# EAGLE design hive_module (EAGLE 9.6.2)
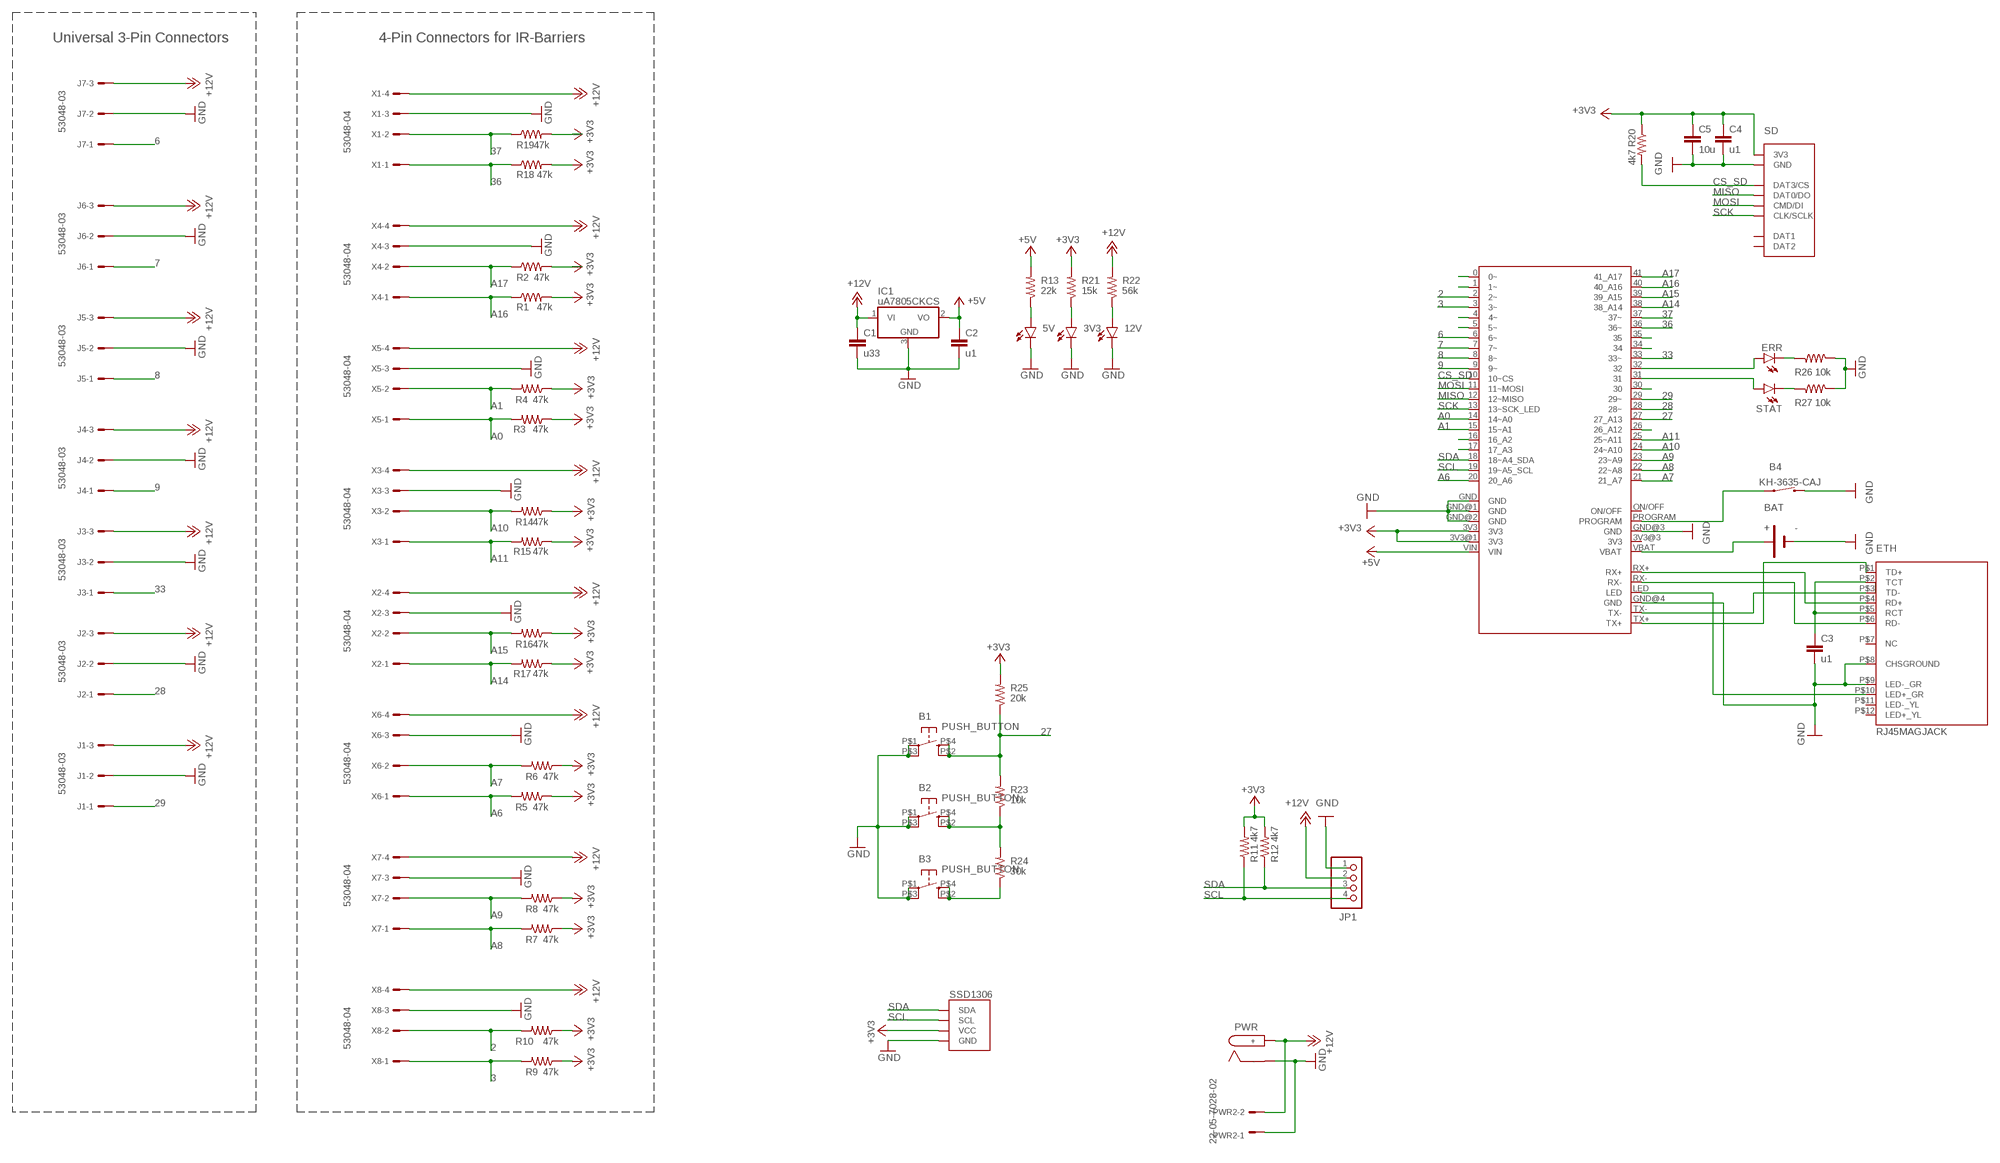
[diagram p0: schematic, sheet 1]

## Parts
3V3  LEDCHIP-LED0805  [CHIP-LED0805]
5V  LEDCHIP-LED0805  [CHIP-LED0805]
12V  LEDCHIP-LED0805  [CHIP-LED0805]
B1  PUSH_BUTTON  [PUSH_BUTTON]
B2  PUSH_BUTTON  [PUSH_BUTTON]
B3  PUSH_BUTTON  [PUSH_BUTTON]
B4  KH-3635-CAJ  [KH-3635-CAJ]
BAT  BS-08-B2AA002  [BS-08-B2AA002]
C1  u33  C-EUC0805  [C0805]
C2  u1  C-EUC0805  [C0805]
C3  u1  C-EUC0805  [C0805]
C4  u1  C-EUC0805  [C0805]
C5  10u  C-EUC0805  [C0805]
ERR  LEDCHIP-LED0805  [CHIP-LED0805]
ETH  RJ45MAGJACK  [LPJ4012AHNL]
IC1  uA7805CKCS  7805_TO252  [TO252]
J1  53048-03  [53048-03]
J2  53048-03  [53048-03]
J3  53048-03  [53048-03]
J4  53048-03  [53048-03]
J5  53048-03  [53048-03]
J6  53048-03  [53048-03]
J7  53048-03  [53048-03]
JP1  PINHD-1X4  [1X04]
PWR  DC-042C-Z-2.5-A  [DC-042C-Z-2.5-A]
PWR2  22-05-7028-02  [7395-02]
R1  47k  R-US_R0805  [R0805]
R2  47k  R-US_R0805  [R0805]
R3  47k  R-US_R0805  [R0805]
R4  47k  R-US_R0805  [R0805]
R5  47k  R-US_R0805  [R0805]
R6  47k  R-US_R0805  [R0805]
R7  47k  R-US_R0805  [R0805]
R8  47k  R-US_R0805  [R0805]
R9  47k  R-US_R0805  [R0805]
R10  47k  R-US_R0805  [R0805]
R11  4k7  R-US_R0805  [R0805]
R12  4k7  R-US_R0805  [R0805]
R13  22k  R-US_R0805  [R0805]
R14  47k  R-US_R0805  [R0805]
R15  47k  R-US_R0805  [R0805]
R16  47k  R-US_R0805  [R0805]
R17  47k  R-US_R0805  [R0805]
R18  47k  R-US_R0805  [R0805]
R19  47k  R-US_R0805  [R0805]
R20  4k7  R-US_R0805  [R0805]
R21  15k  R-US_R0805  [R0805]
R22  56k  R-US_R0805  [R0805]
R23  10k  R-US_R0805  [R0805]
R24  30k  R-US_R0805  [R0805]
R25  20k  R-US_R0805  [R0805]
R26  10k  R-US_R0805  [R0805]
R27  10k  R-US_R0805  [R0805]
SD  TF-011  [TF-011]
SSD1306  SSD1306  [SSD1306]
STAT  LEDCHIP-LED0805  [CHIP-LED0805]
U$1  TEENSY41  [TEENSY41]
X1  53048-04  [53048-04]
X2  53048-04  [53048-04]
X3  53048-04  [53048-04]
X4  53048-04  [53048-04]
X5  53048-04  [53048-04]
X6  53048-04  [53048-04]
X7  53048-04  [53048-04]
X8  53048-04  [53048-04]

## Nets
2: R10.2 U$1.2(2~) X8.2
3: R9.2 U$1.3(3~) X8.1
6: J7.1 U$1.6(6~)
7: J6.1 U$1.7(7~)
8: J5.1 U$1.8(8~)
9: J4.1 U$1.9(9~)
27: B1.P$2(S1) B1.P$4(S) R23.2 R25.1 U$1.27(27_A13)
28: J2.1 U$1.28(28~)
29: J1.1 U$1.29(29~)
33: J3.1 U$1.33(33~)
36: R18.1 U$1.36(36~) X1.1
37: R19.1 U$1.37(37~) X1.2
+3V3: C4.1 C5.1 R1.2 R2.2 R3.1 R4.1 R5.1 R6.1 R7.1 R8.1 R9.1 R10.1 R11.2 R12.2 R14.1 R15.1 R16.1 R17.1 R18.2 R19.2 R20.1 R21.2 R25.2 SD.P$4(3V3) SSD1306.P$2(VCC) U$1.3V3 U$1.3V3@1(3V3)
+5V: C2.1 IC1.2(VO) R13.2 U$1.VIN
+12V: C1.1 IC1.1(VI) J1.3 J2.3 J3.3 J4.3 J5.3 J6.3 J7.3 JP1.2 PWR2.2 PWR.P$6(+) R22.2 X1.4 X2.4 X3.4 X4.4 X5.4 X6.4 X7.4 X8.4
A0: R3.2 U$1.14(14~A0) X5.1
A1: R4.2 U$1.15(15~A1) X5.2
A6: R5.2 U$1.20(20_A6) X6.1
A7: R6.2 U$1.21(21_A7) X6.2
A8: R7.2 U$1.22(22~A8) X7.1
A9: R8.2 U$1.23(23~A9) X7.2
A10: R14.2 U$1.24(24~A10) X3.2
A11: R15.2 U$1.25(25~A11) X3.1
A14: R17.2 U$1.38(38_A14) X2.1
A15: R16.2 U$1.39(39_A15) X2.2
A16: R1.1 U$1.40(40_A16) X4.1
A17: R2.1 U$1.41(41_A17) X4.2
CS_SD: R20.2 SD.P$2(DAT3/CS) U$1.10(10~CS)
GND: 3V3.C 5V.C 12V.C B1.P$1(P) B1.P$3(P1) B2.P$1(P) B2.P$3(P1) B3.P$1(P) B3.P$3(P1) B4.P$2 BAT.- C1.2 C2.2 C3.2 C4.2 C5.2 ETH.P$8(CHSGROUND) ETH.P$9(LED-_GR) IC1.3(GND) J1.2 J2.2 J3.2 J4.2 J5.2 J6.2 J7.2 JP1.1 PWR2.1 PWR.P$1(-) PWR.P$2(-) PWR.P$3(-) PWR.P$4(-) PWR.P$5(-) R26.2 R27.2 SD.P$6(GND) SD.P$9(GND) SD.P$10(GND) SD.P$11(GND) SD.P$12(GND) SSD1306.P$1(GND) U$1.GND U$1.GND@1(GND) U$1.GND@2(GND) U$1.GND@3(GND) U$1.GND@4(GND) X1.3 X2.3 X3.3 X4.3 X5.3 X6.3 X7.3 X8.3
MISO: SD.P$7(DAT0/DO) U$1.12(12~MISO)
MOSI: SD.P$3(CMD/DI) U$1.11(11~MOSI)
N$1: ETH.P$1(TD+) U$1.TX+
N$2: ETH.P$3(TD-) U$1.TX-
N$3: 3V3.A R21.1
N$4: ETH.P$6(RD-) U$1.RX-
N$5: ETH.P$4(RD+) U$1.RX+
N$6: ETH.P$10(LED+_GR) U$1.LED
N$7: 12V.A R22.1
N$8: C3.1 ETH.P$2(TCT) ETH.P$5(RCT)
N$9: BAT.+ U$1.VBAT
N$10: B4.P$1 U$1.PROGRAM
N$11: ERR.A U$1.32
N$12: B3.P$2(S1) B3.P$4(S) R24.1
N$13: B2.P$2(S1) B2.P$4(S) R23.1 R24.2
N$14: U$1.0(0~)
N$15: U$1.1(1~)
N$16: U$1.4(4~)
N$17: U$1.5(5~)
N$18: U$1.35
N$19: U$1.34
N$20: ERR.C R26.1
N$21: R27.1 STAT.C
N$22: STAT.A U$1.31
N$23: U$1.30
N$24: U$1.26(26_A12)
N$25: 5V.A R13.1
N$26: U$1.16(16_A2)
N$27: U$1.17(17_A3)
SCK: SD.P$5(CLK/SCLK) U$1.13(13~SCK_LED)
SCL: JP1.4 R11.1 SSD1306.P$3(SCL) U$1.19(19~A5_SCL)
SDA: JP1.3 R12.1 SSD1306.P$4(SDA) U$1.18(18~A4_SDA)
Unconnected: ETH.P$7(NC) ETH.P$11(LED-_YL) ETH.P$12(LED+_YL) SD.P$1(DAT2) SD.P$8(DAT1) U$1.3V3@3(3V3) U$1.ON/OFF

## Notes on the sheet
- Universal 3-Pin Connectors | 4-Pin Connectors for IR-Barriers

## Library data of the parts
3V3 5V 12V ERR STAT = led:LED: LED OSRAM: - CHIPLED LG R971, LG N971, LY N971, LG Q971, LY Q971, LO R971, LY R971 LH N974, LH R974 LS Q976, LO Q976, LY Q976 LO Q996 - Hyper CHIPLED LW Q18S LB Q993, LB Q99A, LB R99A - SideLED LS A670, LO A670, LY A670, LG A670, LP A670 LB A673, LV A673, LT A673, LW A673 LH A674 LY A675 LS A676, LA A676, LO A676, LY A676, LW A676 LS A679, LY A679, LG A679 - Hyper Micro SIDELED® LS Y876, LA Y876, LO Y876, LY Y876 LT Y87S - SmartLED LW L88C, LW L88S LB L89C, LB L89S, LG L890 LS L89K, LO L89K, LY L89K LS L896, LA L896, LO L896, LY L896 - TOPLED LS T670, LO T670, LY T670, LG T670, LP T670 LSG T670, LSP T670, LSY T670, LOP T670, LYG T670 LG T671, LOG T671, LSG T671 LB T673, LV T673, LT T673, LW T673 LH T674 LS T676, LA T676, LO T676, LY T676, LB T676, LH T676, LSB T676, LW T676 LB T67C, LV T67C, LT T67C, LS T67K, LO T67K, LY T67K, LW E67C LS E67B, LA E67B, LO E67B, LY E67B, LB E67C, LV E67C, LT E67C LW T67C LS T679, LY T679, LG T679 LS T770, LO T770, LY T770, LG T770, LP T770 LB T773, LV T773, LT T773, LW T773 LH T774 LS E675, LA E675, LY E675, LS T675 LS T776, LA T776, LO T776, LY T776, LB T776 LHGB T686 LT T68C, LB T68C - Hyper Mini TOPLED® LB M676 - Mini TOPLED Santana® LG M470 LS M47K, LO M47K, LY M47K Source: http://www.osram.convergy.de LUXEON: - LUMILED® LXK2-PW12-R00, LXK2-PW12-S00, LXK2-PW14-U00, LXK2-PW14-V00 LXK2-PM12-R00, LXK2-PM12-S00, LXK2-PM14-U00 LXK2-PE12-Q00, LXK2-PE12-R00, LXK2-PE12-S00, LXK2-PE14-T00, LXK2-PE14-U00 LXK2-PB12-K00, LXK2-PB12-L00, LXK2-PB12-M00, LXK2-PB14-N00, LXK2-PB14-P00, LXK2-PB14-Q00 LXK2-PR12-L00, LXK2-PR12-M00, LXK2-PR14-Q00, LXK2-PR14-R00 LXK2-PD12-Q00, LXK2-PD12-R00, LXK2-PD12-S00 LXK2-PH12-R00, LXK2-PH12-S00 LXK2-PL12-P00, LXK2-PL12-Q00, LXK2-PL12-R00 Source: www.luxeon.com KINGBRIGHT: KA-3528ASYC Source: www.kingbright.com
B1-B3 = 000-my_library:PUSH_BUTTON: K2-6639SP-I4SC-04 C127507 jlcpcb
B4 = 000-my_library:KH-3635-CAJ
BAT = 000-my_library:BS-08-B2AA002
C1-C5 = rcl:C-EU: CAPACITOR, European symbol; SPICEPREFIX: C
ETH = 000-my_library:RJ45MAGJACK
IC1 = 000-my_library:7805_TO252
J1-J7 = con-molex:53?-03: CONNECTOR wire to board 1.25 mm (.049 inch) pitch header; MF: WALDOM/MOLEX; MPN: 53048-0310; OC_FARNELL: 9732918; OC_NEWARK: 38C9908
JP1 = pinhead:PINHD-1X4: PIN HEADER
PWR = 000-my_library:DC-042C-Z-2.5-A
PWR2 = con-molex:22-?-02: CONNECTOR wire to board 2.54 mm (.1 inch) pitch header; MF: MOLEX; OC_FARNELL: 9731601; OC_NEWARK: unknown
R1-R27 = rcl:R-US_: RESISTOR, American symbol; SPICEPREFIX: R
SD = 000-my_library:TF-011
SSD1306 = 000-my_library:SSD1306
U$1 = 000-my_library:TEENSY41
X1-X8 = con-molex:53?-04: CONNECTOR wire to board 1.25 mm (.049 inch) pitch header; MF: MOLEX; MPN: 53048-0410; OC_FARNELL: 1462887; OC_NEWARK: 57H4721

## Board
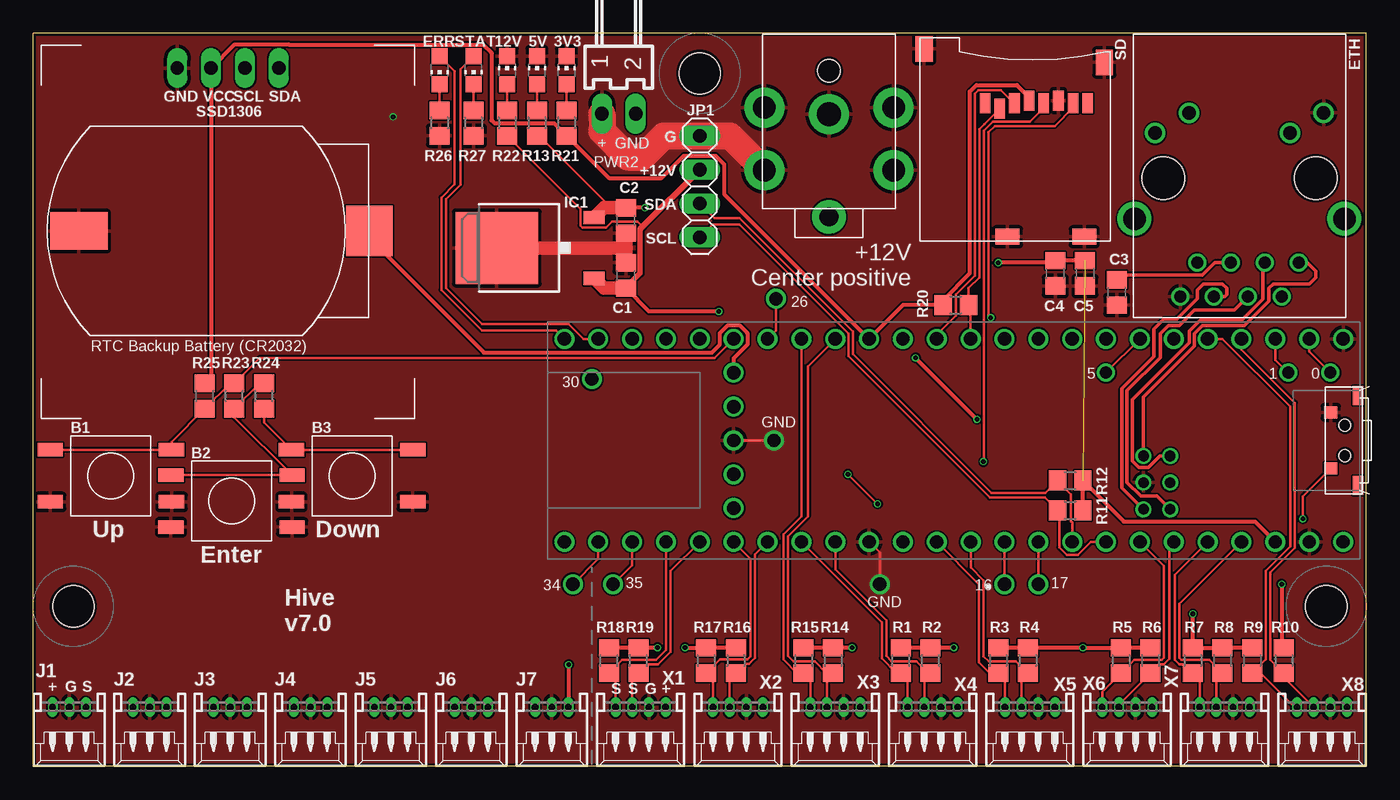
[diagram p1: board, top side]
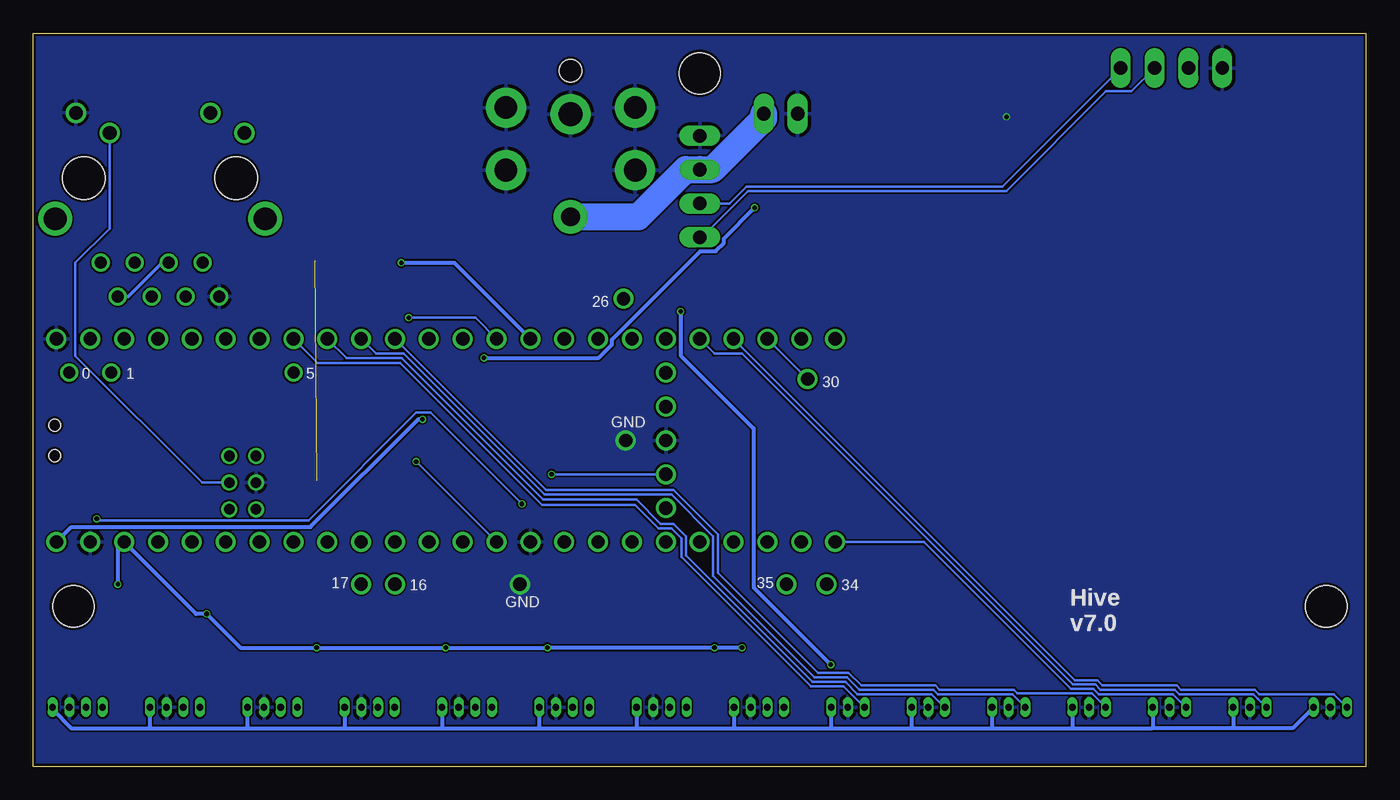
[diagram p2: board, bottom side, seen from below]

Size 100 x 55 mm. Coordinates in mm from the lower left corner, seen from the top.
Outline: 100,0 100,55 0,55 0,0 100,0
Copper layers (1*16): Top 0.035559375mm / dielectric 1.6mm / Bottom 0.035559375mm
Design rules "jlcpcb2layer": minimum track width 5mil, minimum drill 12mil, track to track 5mil, track to pad 5mil, pad to pad 5mil, via to via 5mil, smd to smd 5mil, copper to edge 8mil, drill to drill 6mil, minimum pad ring 5mil, minimum via ring 3mil, stop-mask expansion 2.5mil, vias tented up to drill 0mil, thermal gap 10mil
Holes 3.1 mm at 50,52 3,12 97,12

### Footprints (pad centres in the part's own frame; a part is rotated, then mirrored left to right if it is on the bottom)
CHIP-LED0805 = smd 1.2 x 1.2: A 0,-1.05; C 0,1.05
PUSH_BUTTON = smd 1.9 x 1: P$1 0,0; P$2 0,3.9; P$3 9.1,0; P$4 9.1,3.9
KH-3635-CAJ = smd 0.9 x 1: P$1 -2.1,1.05; P$2 2.1,1.05 | smd 1.45 x 0.8: P$3 -3.375,-1; P$4 3.375,-1 | hole 0.9: -1.15,0; 1.15,0
BS-08-B2AA002 = smd 3.5 x 3.8: + 13,0 | smd 4.3 x 2.8: - -8.8,0
C0805 = smd 1.3 x 1.5: 1 -0.95,0; 2 0.95,0
LPJ4012AHNL = drill 0.9: P$1 -4.445,6.35; P$2 -3.175,8.89; P$3 -1.905,6.35; P$4 -0.635,8.89; P$5 0.635,6.35; P$6 1.905,8.89; P$7 3.175,6.35; P$8 4.445,8.89 | drill 1.02: P$9 -6.325,-4.9; P$10 -3.785,-3.38; P$11 3.785,-4.9; P$12 6.325,-3.38 | drill 1.7: P$13 -7.875,3.05; P$14 7.875,3.05 | hole 3.2: -5.715,0; 5.715,0
TO252 = smd 1 x 1.6: 1 -2.28,-4.8; 2 2.28,-4.8 | smd 5.4 x 6.2: 3 0,2.5
53048-03 = drill 0.5 pad 0.698 long: 1 1.25,-1.25; 2 0,-1.25; 3 -1.25,-1.25
1X04 = drill 1.016 long: 1 -3.81,0; 2 -1.27,0; 3 1.27,0; 4 3.81,0
DC-042C-Z-2.5-A = drill 1.7 pad 3: P$1 5.5,4.85; P$2 10.2,4.85; P$3 5.5,-4.85; P$4 10.2,-4.85 | drill 1.8 pad 3: P$5 6,0 | drill 1.4 pad 2.54: P$6 13.7,0 | hole 1.7: 2.75,0
7395-02 = drill 1.016 long: 1 1.27,0; 2 -1.27,0
R0805 = smd 1.3 x 1.5: 1 -0.95,0; 2 0.95,0
TF-011 = smd 0.8 x 1.5: P$1 8.94,3.06; P$2 7.84,3.46; P$3 6.74,3.06; P$4 5.64,2.86; P$5 4.54,3.06; P$6 3.44,2.86; P$7 2.34,3.06; P$8 1.24,3.06 | smd 1.3 x 1.9: P$9 13.52,-1.02; P$10 0,0 | smd 1.8 x 1.2: P$11 1.51,13.08; P$12 7.26,13.08
SSD1306 = drill 1 long: P$1 -3.81,0; P$2 -1.27,0; P$3 1.27,0; P$4 3.81,0
TEENSY41 = drill 1: 0 2.54,0; 1 5.08,0; 2 7.62,0; 3 10.16,0; 3V3 35.56,0; 3V3@1 5.08,15.24; 3V3@3 45.72,5.08; 4 12.7,0; 5 15.24,0; 6 17.78,0; 7 20.32,0; 8 22.86,0; 9 25.4,0; 10 27.94,0; 11 30.48,0; 12 33.02,0; 13 33.02,15.24; 14 30.48,15.24; 15 27.94,15.24; 16 25.4,15.24; 17 22.86,15.24; 18 20.32,15.24; 19 17.78,15.24; 20 15.24,15.24; 21 12.7,15.24; 22 10.16,15.24; 23 7.62,15.24; 24 38.1,0; 25 40.64,0; 26 43.18,0; 27 45.72,0; 28 48.26,0; 29 50.8,0; 30 53.34,0; 31 55.88,0; 32 58.42,0; 33 58.42,15.24; 34 55.88,15.24; 35 53.34,15.24; 36 50.8,15.24; 37 48.26,15.24; 38 45.72,15.24; 39 43.18,15.24; 40 40.64,15.24; 41 38.1,15.24; GND 0,0; GND@1 35.56,15.24; GND@2 2.54,15.24; GND@4 45.72,7.62; ON/OFF 45.72,12.7; PROGRAM 45.72,10.16; VBAT 45.72,2.54; VIN 0,15.24 | drill 0.8: GND@3 14.97,10.79; LED 12.97,10.79; RX+ 12.97,12.79; RX- 14.97,12.79; TX+ 14.97,8.79; TX- 12.97,8.79
53048-04 = drill 0.5 pad 0.698 long: 1 1.875,-1.25; 2 0.625,-1.25; 3 -0.625,-1.25; 4 -1.875,-1.25

### Placement (x,y rotation side)
3V3  40.01,52.23 0 top
5V  37.78,52.23 0 top
12V  35.56,52.23 0 top
B1  1.27,19.84 0 top
B2  10.32,17.94 0 top
B3  19.37,19.84 0 top
B4  98.4,24.45 90 top
BAT  12.22,40.16 0 top
C1  44.45,36.83 90 top
C2  44.45,40.96 270 top
C3  81.28,35.56 270 top
C4  76.68,36.99 270 top
C5  78.9,36.99 270 top
ERR  30.48,52.23 180 top
ETH  90.49,44.13 180 top
IC1  37.27,38.89 90 top
J1  2.7,3.17 180 top
J2  8.73,3.17 180 top
J3  14.76,3.17 180 top
J4  20.8,3.17 180 top
J5  26.83,3.17 180 top
J6  32.86,3.17 180 top
J7  38.89,3.17 180 top
JP1  50,43.5 270 top
PWR  59.69,54.93 270 top
PWR2  43.92,48.97 180 top
R1  65.09,7.94 90 top
R2  67.31,7.94 90 top
R3  72.39,7.94 270 top
R4  74.61,7.94 270 top
R5  81.6,7.94 270 top
R6  83.82,7.94 270 top
R7  87,7.94 270 top
R8  89.22,7.94 270 top
R9  91.44,7.94 270 top
R10  93.82,7.94 270 top
R11  77.79,19.21 0 top
R12  77.79,21.43 0 top
R13  37.78,48.26 270 top
R14  60.01,7.94 270 top
R15  57.78,7.94 270 top
R16  52.7,7.94 270 top
R17  50.48,7.94 270 top
R18  43.18,7.94 90 top
R19  45.4,7.94 90 top
R20  69.22,34.61 0 top
R21  40.01,48.26 270 top
R22  35.56,48.26 270 top
R23  15.08,27.78 90 top
R24  17.3,27.78 90 top
R25  12.86,27.78 90 top
R26  30.48,48.26 270 top
R27  33.02,48.26 270 top
SD  80.35,52.82 180 top
SSD1306  14.61,52.39 0 top
STAT  33.02,52.23 180 top
U$1  98.27,32.07 180 top
X1  45.56,3.17 180 top
X2  52.86,3.17 180 top
X3  60.17,3.17 180 top
X4  67.47,3.17 180 top
X5  74.77,3.17 180 top
X6  82.07,3.17 180 top
X7  89.38,3.17 180 top
X8  96.68,3.17 180 top

### Tracks (layer width: path | path; a pad name or v marks a point on that pad's centre or on a via)
2
  Top 0.203: U$1.2 90.65,31.27 94.65,27.27 94.65,16.36 92.82,14.53 92.82,7.99 R10.2 93.82,6.67 96.05,4.44 X8.2
3
  Top 0.203: U$1.3 89.22,32.07 94.3,26.99 94.3,16.51 92.46,14.67 92.46,8.01 R9.2 92.08,6.99 94.64,4.42 X8.1
6
  Bottom 0.203: U$1.6 78.68,30.26 72.49,30.26 61.84,19.62 54.86,19.62 53.08,17.84 52.13,17.84 51.38,17.09 51.38,15.7 41.67,5.99 39.21,5.99 J7.1
7
  Bottom 0.203: U$1.7 76.5,30.62 72.37,30.62 61.75,20 54.74,20 52.93,18.19 51.98,18.19 51.02,17.23 51.02,15.81 41.54,6.32 39.07,6.32 38.16,5.41 32.61,5.41 31.63,4.42 J6.1
8
  Bottom 0.203: U$1.8 74.3,30.96 72.23,30.96 61.65,20.38 52.13,20.38 49,17.25 49,14.29 41.39,6.68 38.96,6.68 38.02,5.74 32.47,5.74 32.14,5.41 26.56,5.41 J5.1
9
  Bottom 0.203: U$1.9 61.53,20.73 51.98,20.73 48.64,17.39 48.64,14.52 41.14,7.01 38.83,7.01 37.89,6.07 32.34,6.07 32.01,5.74 26.43,5.74 26.16,5.47 20.59,5.47 J4.1
27
  Top 0.203: B1.P$2 B1.P$4 10.37,24.34 R25.1 14.76,28.73 R23.2 16.99,30.64 51.12,30.64 U$1.27
28
  Bottom 0.203: U$1.28 48.9,30.96 46.83,30.96 22.01,6.13 20.32,6.13 19.93,5.74 14.36,5.74 14.03,5.41 8.48,5.41 8.13,5.06 8.12,5.06 J2.1
29
  Bottom 0.203: J1.1 2.43,5.41 8.01,5.41 8.34,5.74 13.89,5.74 14.22,6.07 19.79,6.07 20.18,6.46 21.86,6.46 U$1.29
33
  Bottom 0.203: U$1.33 33.18,16.83 22.15,5.8 20.46,5.8 20.06,5.41 14.5,5.41 J3.1
36
  Top 0.203: U$1.36 47.47,8.72 46.73,7.98 44.18,7.98 R18.1 43.69,6.48 X1.1
37
  Top 0.203: U$1.37 47.83,14.65 47.83,8.57 46.88,7.63 46.04,7.63 R19.1 44.94,6.52 X1.2
+3V3  (via drill 0.35)  (1 unrouted)
  Top 0.305: R8.1 R7.1 v87,11.43 | R8.1 | v69.06,8.89 v69.05,8.89 R2.2 R1.2 | R6.1 R5.1 v78.74,8.89 R4.1 R3.1 | R15.1 R14.1 v61.43,8.89 v61.44,8.89 | R18.2 R19.2 v46.83,8.89 | 52.86,8.89 R16.1 R17.1 | 50.64,8.89 R17.1 | R11.2 R12.2 81.81,18.36 91.65,18.36 U$1.3V3@1 | R9.1 R8.1 | v93.66,13.65 93.66,9.05 R10.1 | v48.9,8.89 R17.1 | C5.1 C4.1 76.52,37.78 v72.39,37.78 | R25.2 13.34,29.21 SSD1306.P$2 15.11,54.17 19.16,54.17 19.17,54.16 33.74,54.16 34.37,53.53 34.37,48.48 34.61,48.24 39.08,48.24 R21.2 43.18,44.13 47.13,44.13 48.81,45.81 51.19,45.81 51.83,45.17 51.83,42.94 U$1.3V3 65.25,34.61 R20.1 68.27,34.99 70.26,36.99 70.26,50.62 70.76,51.12 73.8,51.12 74.71,50.2 SD.P$4
  Bottom 0.305: v93.66,13.65 93.66,16.35 U$1.3V3@1 87.79,11.43 v87,11.43 84.45,8.89 v78.74,8.89 v69.06,8.89 v61.44,8.89 v48.9,8.89 v46.83,8.89 | v72.39,37.78 68.42,37.78 U$1.3V3
+5V  (via drill 0.35)
  Top 0.203: R13.2 37.94,47.31 43.34,41.91 C2.1
  Top 0.305: v70.8,26.04 v66.2,30.64 | v45.88,41.91 C2.1
  Top 1.016: IC1.2 42.81,41.91 C2.1
  Bottom 0.305: U$1.VIN 97.16,17.94 79.22,17.94 71.12,26.04 v70.8,26.04 | v45.88,41.91 48.2,39.59 48.2,39.26 48.81,38.65 49.96,38.65 56.6,32.01 56.6,31.64 57.6,30.64 v66.2,30.64
+12V  (via drill 0.35)
  Top 0.203: R22.2 41.05,41.82 41.05,40.58 41.19,40.44 42.96,40.44 43.41,40.89 45.31,40.89 45.72,40.49
  Top 0.305: C1.1 46.2,34.13 v51.43,34.13 v51.44,34.13 | v40.16,7.62 40.16,4.45 J7.3
  Top 0.406: JP1.2 45.72,40.49 45.53,40.3 45.53,36.99 44.45,35.91 C1.1
  Top 1.016: IC1.1 42.81,35.88 C1.1
  Bottom 0.305: X8.4 98.55,4.26 97.16,2.86 91.25,2.86 | X7.4 91.25,2.86 | X6.4 83.95,2.86 | X5.4 76.65,2.86 | 34.11,2.86 28.1,2.86 | 22.05,2.86 16.03,2.86 | X4.4 69.34,2.86 | X3.4 62.04,2.86 | X2.4 54.74,2.86 | X1.4 47.44,2.86 | J7.3 40.14,2.86 | J6.3 34.11,2.86 | J5.3 28.08,2.88 28.1,2.86 | J4.3 22.05,2.86 | J3.3 16.01,2.88 16.03,2.86 | J2.3 9.98,2.86 | J1.3 5.52,2.86 9.98,2.86 | v51.44,34.13 51.44,30.82 45.96,25.35 45.96,13.42 v40.16,7.62 | 9.98,2.86 16.03,2.86 | 91.25,2.86 83.95,2.86 | 83.95,2.86 76.65,2.86 | 76.65,2.86 69.34,2.86 | 69.34,2.86 62.04,2.86 | 62.04,2.86 54.74,2.86 | 54.74,2.86 47.44,2.86 | 47.44,2.86 40.14,2.86 | 40.14,2.86 34.11,2.86 | 28.1,2.86 22.05,2.86
  Bottom 2.032: PWR.P$6 54.6,41.23 51.06,44.77 JP1.2 49.05,44.77 45.19,48.63 PWR2.2
A0
  Top 0.203: U$1.14 70.96,13.65 70.96,7.78 71.75,6.99 R3.2 72.9,6.48 X5.1
A1
  Top 0.203: U$1.15 70.33,14.91 71.29,13.94 71.29,8.26 71.68,7.87 73.73,7.87 R4.2 74.15,6.52 X5.2
A6
  Top 0.203: U$1.20 84.82,15.03 84.82,8.13 84.67,7.98 82.59,7.98 R5.2 80.2,5.59 X6.1
A7
  Top 0.203: U$1.21 85.25,16.51 85.25,8.05 84.82,7.63 84.46,7.63 R6.2 81.45,4.62 X6.2
A8
  Top 0.203: U$1.22 85.64,14.36 85.64,7.99 85.99,7.63 86.36,7.63 R7.2 87.5,6.48 X7.1
A9
  Top 0.203: U$1.23 85.99,12.17 85.99,8.13 86.14,7.98 88.22,7.98 R8.2 88.75,6.52 X7.2
A10
  Top 0.203: U$1.24 58.1,30 58.1,18.73 56.62,17.25 56.62,8.29 57.05,7.87 58.63,7.87 59.51,6.99 R14.2 59.54,6.52 X3.2
A11
  Top 0.203: U$1.25 57.63,18.76 56.26,17.39 56.26,8.03 57.31,6.99 R15.2 58.29,6.48 X3.1
A14
  Top 0.203: U$1.38 53.82,15.56 53.82,8.26 53.57,8.01 51.5,8.01 R17.2 50.99,6.48 X2.1
A15
  Top 0.203: U$1.39 54.15,15.89 54.15,8.12 53.71,7.68 53.4,7.68 R16.2 52.24,6.52 X2.2
A16
  Top 0.203: U$1.40 63.66,10.79 63.66,8.1 64.77,6.99 R1.1 65.59,6.48 X4.1
A17
  Top 0.203: U$1.41 60.17,14.76 63.99,10.94 63.99,8.26 64.39,7.87 66.25,7.87 67.13,6.99 R2.1 66.84,6.52 X4.2
CS_SD
  Top 0.203: SD.P$2 71.35,48.19 70.97,47.82 70.97,36.69 70.17,35.88 R20.2 70.32,34.45 U$1.10
GND  (via drill 0.35, 1)
  Top 0.203: U$1.GND@4 v55.56,24.45 | U$1.GND@1 63.5,16.03 v63.5,13.65
  Top 1.016: C2.2 44.45,38.89 | 44.45,38.89 C1.2 | 44.45,38.89 IC1.3
  Top 2.032: PWR2.1 42.65,47.68 44.61,45.72 45.72,45.72 47.31,47.31 JP1.1 52.26,47.31 PWR.P$4
  other vias: 26.99,48.74
  pour Bottom: -0.6,-0.83 100.76,-0.83 100.76,55.56 -0.6,55.56
  pour Top: -1.27,56.2 101.36,56.2 101.36,-1.21 -1.27,-1.21
MISO  (via drill 0.35)
  Top 0.203: SD.P$7 78.01,49.42 76.64,48.05 72.14,48.05 71.67,47.58 71.67,33.82 v71.83,33.66
  Bottom 0.203: v71.83,33.66 66.83,33.66 U$1.12
MOSI
  Top 0.203: SD.P$3 73.59,49.76 72.61,50.73 71.28,50.73 70.92,50.73 70.64,50.46 70.64,36.83 69.22,35.4 69.22,33.83 67.79,32.41 U$1.11
N$1
  Top 0.254: U$1.TX+ 83.3,27.72 87.1,31.53 87.1,32.48 87.69,33.07 90.86,33.07 92.71,34.92 92.71,35.88 93.03,36.2 95.73,36.2 96.2,36.67 96.2,37.15 95.57,37.78 ETH.P$1
N$2
  Top 0.254: ETH.P$3 92.23,37.62 92.23,35.04 90.71,33.52 87.6,33.52 86.72,32.64 86.72,31.8 82.44,27.52 82.44,22.92 82.94,22.42 83.65,22.42 84.5,23.28 U$1.TX-
N$3
  Top 0.203: 3V3.A R21.1
N$4
  Top 0.254: U$1.RX- 81.68,20.89 81.68,28.34 84.09,30.75 84.09,32.8 84.83,33.55 85.78,33.55 87.31,35.08 87.31,35.72 87.79,36.2 89.22,36.2 89.53,35.88 89.53,35.4 89.38,35.24 ETH.P$6
N$5
  Top 0.254: ETH.P$4 90.1,34.22 87.12,34.22 85.98,33.07 85.15,33.07 84.56,32.48 84.56,30.68 82.06,28.18 82.06,21.3 83.1,20.27 84.31,20.27 U$1.RX+
N$6
  Bottom 0.203: ETH.P$10 94.27,40.35 96.84,37.78 96.84,30.8 87.32,21.28 U$1.LED
N$7
  Top 0.203: 12V.A R22.1
N$8
  Top 0.254: ETH.P$5 88.63,37.78 87.7,36.85 81.62,36.85 C3.1
  Bottom 0.254: ETH.P$2 92.87,35.24 90.33,37.78 ETH.P$5
N$9
  Top 0.305: U$1.VBAT 52.55,30.61 53.58,31.64 53.58,32.49 52.97,33.1 52.12,33.1 51.52,32.49 51.52,31.65 50.91,31.04 33.8,31.04 25.22,39.62 BAT.+
N$10  (via drill 0.35)
  Top 0.203: B4.P$1 95.25,20.25 v95.25,18.57 | v63.34,19.68 v61.12,21.91
  Bottom 0.203: U$1.PROGRAM v61.12,21.91 | v95.25,18.57 95.12,18.45 79.34,18.45 71.26,26.53 70.18,26.53 v63.34,19.68
N$11
  Top 0.203: ERR.A 31.62,52.14 31.62,43.67 30.63,42.68 30.63,35.74 33.66,32.7 39.21,32.7 U$1.32
N$12
  Top 0.203: B3.P$4 B3.P$2 17.3,25.81 R24.1
N$13
  Top 0.203: B2.P$2 B2.P$4 15.08,26.18 R23.1 16.98,28.73 R24.2
N$14  (via drill 0.9)
  Top 0.203: U$1.0 95.73,31.11 v97.31,29.53
N$15  (via drill 0.9)
  Top 0.203: U$1.1 93.19,30.48 v94.14,29.53
N$17  (via drill 0.9)
  Top 0.203: U$1.5 v80.49,29.53
N$18  (via drill 1)
  Top 0.203: U$1.35 44.93,15.08 v43.5,13.65
N$19  (via drill 1)
  Top 0.203: U$1.34 42.39,15.56 v40.48,13.65
N$20
  Top 0.203: ERR.C R26.1
N$21
  Top 0.203: STAT.C R27.1
N$22
  Top 0.203: STAT.A 32.04,52.3 32.04,43.63 30.96,42.55 30.96,35.88 33.66,33.18 40.16,33.18 41.27,32.07 U$1.31
N$23  (via drill 1)
  Bottom 0.203: U$1.30 v41.91,29.05
N$24  (via drill 1)
  Top 0.203: U$1.26 55.72,32.7 v55.72,35.08
N$25
  Top 0.203: 5V.A R13.1
N$26  (via drill 1)
  Top 0.203: U$1.16 v72.87,13.65
N$27  (via drill 1)
  Top 0.203: U$1.17 v75.41,13.65
SCK  (via drill 0.35)
  Top 0.203: SD.P$5 75.81,49.42 74.77,48.38 72,48.38 71.31,47.68 71.31,22.89 v71.28,22.86
  Bottom 0.203: v71.28,22.86 U$1.13
SCL
  Top 0.203: JP1.4 50.95,40.64 52.98,40.64 61.15,32.47 61.15,30.77 71.75,20.16 75.89,20.16 R11.1 76.97,19.08 76.97,16.42 77.54,15.85 78.35,15.85 79.33,16.83 U$1.19
  Bottom 0.203: SSD1306.P$3 17.6,50.66 19.52,50.66 27.01,43.17 46.36,43.17 49.84,39.69 JP1.4
SDA
  Top 0.203: JP1.3 51.11,41.12 52.97,41.12 61.48,32.61 61.48,30.92 71.87,20.52 75.93,20.52 R12.1 77.86,20.41 77.86,18.36 77.95,18.28 U$1.18
  Bottom 0.203: SSD1306.P$4 27.3,43.5 46.51,43.5 47.78,42.23 JP1.3

### Text on the board
tNames: G | + | GND | +12V | SDA | SCL | +12V / Center positive | 26 | RTC Backup Battery (CR2032) | 5 | 1 | 0 | 30 | GND | Up | Down | Enter | 34 | 35 | 16 | 17 | GND | Hive / v7.0 | + | G | S | S | S | G | +
bNames: 26 | 5 | 1 | 0 | 30 | GND | 34 | 35 | 16 | 17 | GND | Hive / v7.0
tDocu: IR Barriers
200bmp: ModMoPSS | Mouse Position Surveillance System | Modular